# EAGLE design Main_board (EAGLE 6.2)
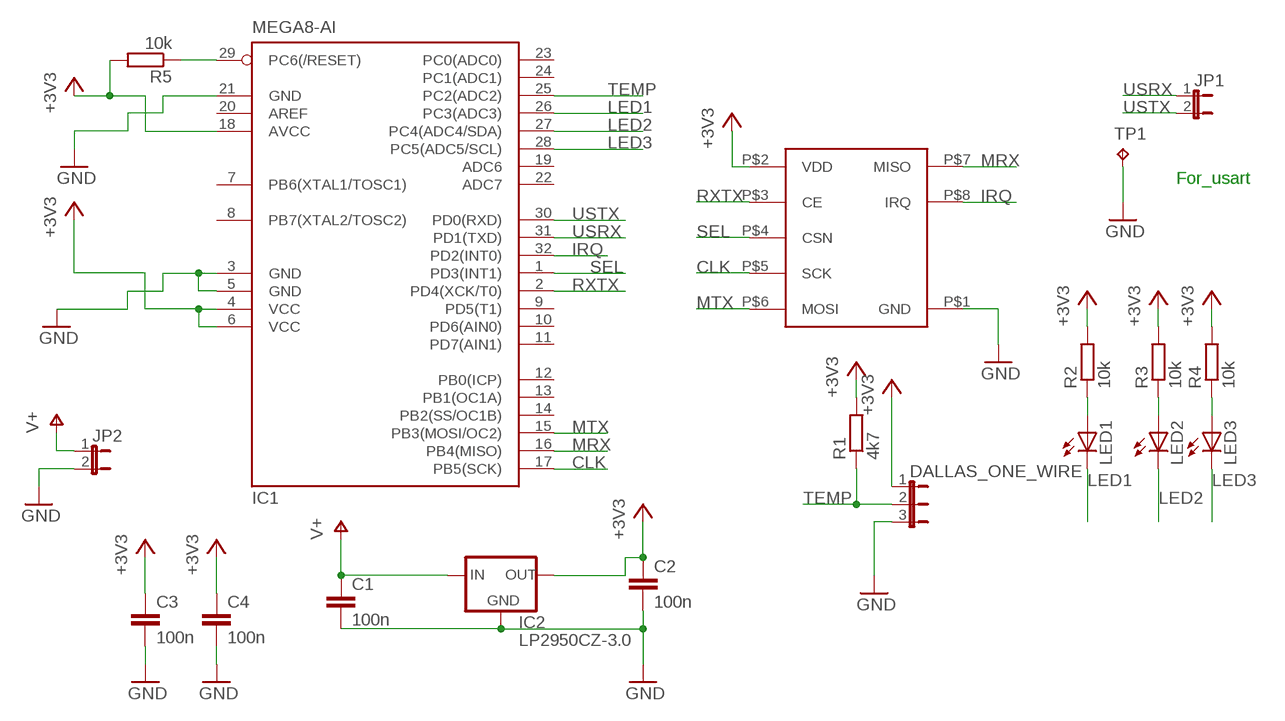
[diagram p0: schematic, sheet 1]

## Parts
C1  100n  C-EUC1206  [C1206]
C2  100n  C-EUC1206  [C1206]
C3  100n  C-EUC1206  [C1206]
C4  100n  C-EUC1206  [C1206]
DALLAS_ONE_WIRE  JP2E  [JP2]
IC1  MEGA8-AI  [TQFP32-08]
IC2  LP2950CZ-3.0  [TO92]
JP1  JP1E  [JP1]
JP2  JP1E  [JP1]
LED1  LEDSMT1206  [1206]
LED2  LEDSMT1206  [1206]
LED3  LEDSMT1206  [1206]
R1  4k7  R-EU_M1206  [M1206]
R2  10k  R-EU_M1206  [M1206]
R3  10k  R-EU_M1206  [M1206]
R4  10k  R-EU_M1206  [M1206]
R5  10k  R-EU_M1206  [M1206]
TP1  TPB2,54  [B2,54]
U$1  RFM70D  [RFM70D]

## Nets
+3V3: C2.1 C3.1 C4.1 DALLAS_ONE_WIRE.1 IC1.4(VCC) IC1.6(VCC) IC1.18(AVCC) IC2.1(OUT) R1.2 R2.2 R3.2 R4.2 R5.2 U$1.P$2(VDD)
CLK: IC1.17(PB5(SCK)) U$1.P$5(SCK)
GND: C1.2 C2.2 C3.2 C4.2 DALLAS_ONE_WIRE.3 IC1.3(GND) IC1.5(GND) IC1.21(GND) IC2.2(GND) JP2.2 TP1.TP U$1.P$1(GND)
IRQ: IC1.32(PD2(INT0)) U$1.P$8(IRQ)
LED1: IC1.26(PC3(ADC3)) LED1.C
LED2: IC1.27(PC4(ADC4/SDA)) LED2.C
LED3: IC1.28(PC5(ADC5/SCL)) LED3.C
MRX: IC1.16(PB4(MISO)) U$1.P$7(MISO)
MTX: IC1.15(PB3(MOSI/OC2)) U$1.P$6(MOSI)
N$1: LED1.A R2.1
N$2: LED2.A R3.1
N$3: LED3.A R4.1
N$4: IC1.29(PC6(/RESET)) R5.1
RXTX: IC1.2(PD4(XCK/T0)) U$1.P$3(CE)
SEL: IC1.1(PD3(INT1)) U$1.P$4(CSN)
TEMP: DALLAS_ONE_WIRE.2 IC1.25(PC2(ADC2)) R1.1
USRX: IC1.31(PD1(TXD)) JP1.1
USTX: IC1.30(PD0(RXD)) JP1.2
V+: C1.1 IC2.3(IN) JP2.1
Unconnected: IC1.7(PB6(XTAL1/TOSC1)) IC1.8(PB7(XTAL2/TOSC2)) IC1.9(PD5(T1)) IC1.10(PD6(AIN0)) IC1.11(PD7(AIN1)) IC1.12(PB0(ICP)) IC1.13(PB1(OC1A)) IC1.14(PB2(SS/OC1B)) IC1.19(ADC6) IC1.20(AREF) IC1.22(ADC7) IC1.23(PC0(ADC0)) IC1.24(PC1(ADC1))

## Notes on the sheet
- For_usart

## Library data of the parts
C1-C4 = rcl:C-EU: CAPACITOR, European symbol
DALLAS_ONE_WIRE = jumper:JP2E: JUMPER
IC1 = atmel:MEGA8: MICROCONTROLLER 8 Kbytes FLASH, 1 kbytes SRAM, 512 bytes EEPROM, USART, 6-channel 10 bit ADC, 2-channel 8 bit ADC Pin compatible with Atmega48, ATMega88, ATMega168 Source: avr.lbr; MPN: ATMEGA8-16AU; OC_FARNELL: 9171371; OC_NEWARK: 73M8863
IC2 = v-reg:LP2950?*: Source: http://cache.national.com/ds/LP/LP2950.pdf
JP1 JP2 = jumper:JP1E: JUMPER
LED1-LED3 = led:LED: LED OSRAM: - CHIPLED LG R971, LG N971, LY N971, LG Q971, LY Q971, LO R971, LY R971 LH N974, LH R974 LS Q976, LO Q976, LY Q976 LO Q996 - Hyper CHIPLED LW Q18S LB Q993, LB Q99A, LB R99A - SideLED LS A670, LO A670, LY A670, LG A670, LP A670 LB A673, LV A673, LT A673, LW A673 LH A674 LY A675 LS A676, LA A676, LO A676, LY A676, LW A676 LS A679, LY A679, LG A679 - Hyper Micro SIDELED® LS Y876, LA Y876, LO Y876, LY Y876 LT Y87S - SmartLED LW L88C, LW L88S LB L89C, LB L89S, LG L890 LS L89K, LO L89K, LY L89K LS L896, LA L896, LO L896, LY L896 - TOPLED LS T670, LO T670, LY T670, LG T670, LP T670 LSG T670, LSP T670, LSY T670, LOP T670, LYG T670 LG T671, LOG T671, LSG T671 LB T673, LV T673, LT T673, LW T673 LH T674 LS T676, LA T676, LO T676, LY T676, LB T676, LH T676, LSB T676, LW T676 LB T67C, LV T67C, LT T67C, LS T67K, LO T67K, LY T67K, LW E67C LS E67B, LA E67B, LO E67B, LY E67B, LB E67C, LV E67C, LT E67C LW T67C LS T679, LY T679, LG T679 LS T770, LO T770, LY T770, LG T770, LP T770 LB T773, LV T773, LT T773, LW T773 LH T774 LS E675, LA E675, LY E675, LS T675 LS T776, LA T776, LO T776, LY T776, LB T776 LHGB T686 LT T68C, LB T68C - Hyper Mini TOPLED® LB M676 - Mini TOPLED Santana® LG M470 LS M47K, LO M47K, LY M47K Source: http://www.osram.convergy.de LUXEON: - LUMILED® LXK2-PW12-R00, LXK2-PW12-S00, LXK2-PW14-U00, LXK2-PW14-V00 LXK2-PM12-R00, LXK2-PM12-S00, LXK2-PM14-U00 LXK2-PE12-Q00, LXK2-PE12-R00, LXK2-PE12-S00, LXK2-PE14-T00, LXK2-PE14-U00 LXK2-PB12-K00, LXK2-PB12-L00, LXK2-PB12-M00, LXK2-PB14-N00, LXK2-PB14-P00, LXK2-PB14-Q00 LXK2-PR12-L00, LXK2-PR12-M00, LXK2-PR14-Q00, LXK2-PR14-R00 LXK2-PD12-Q00, LXK2-PD12-R00, LXK2-PD12-S00 LXK2-PH12-R00, LXK2-PH12-S00 LXK2-PL12-P00, LXK2-PL12-Q00, LXK2-PL12-R00 Source: www.luxeon.com KINGBRIGHT: KA-3528ASYC Source: www.kingbright.com
R1-R5 = rcl:R-EU_: RESISTOR, European symbol
TP1 = testpad:TP: Test pad
U$1 = RFM_Modules:RFM70D

## Board
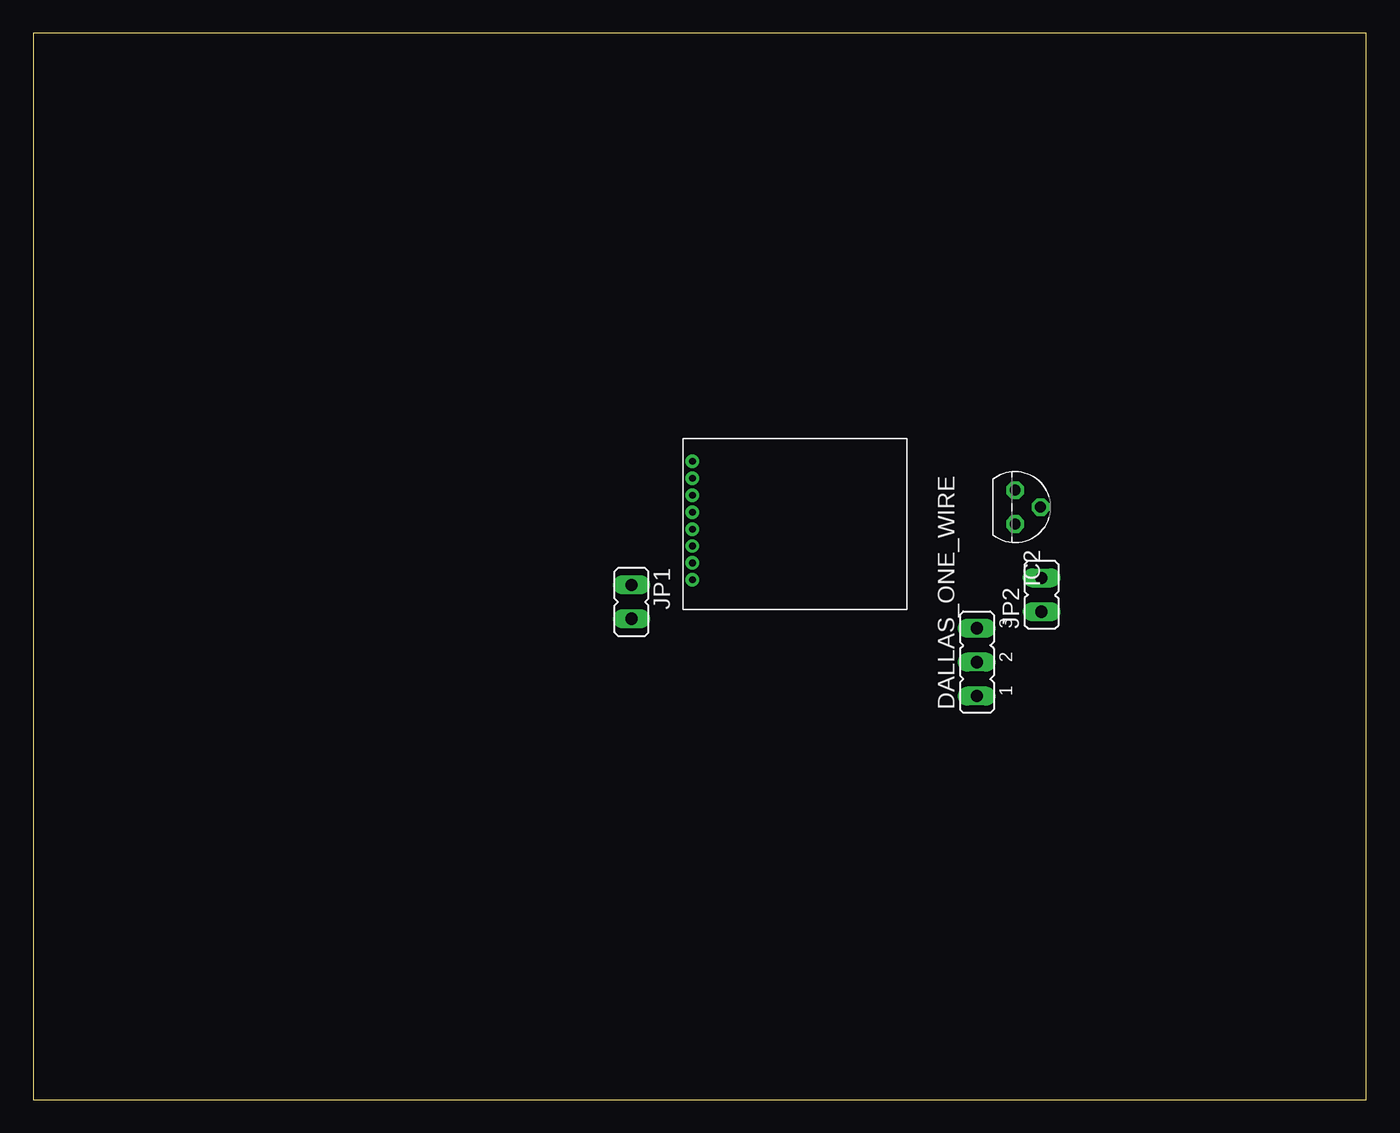
[diagram p1: board, top side]
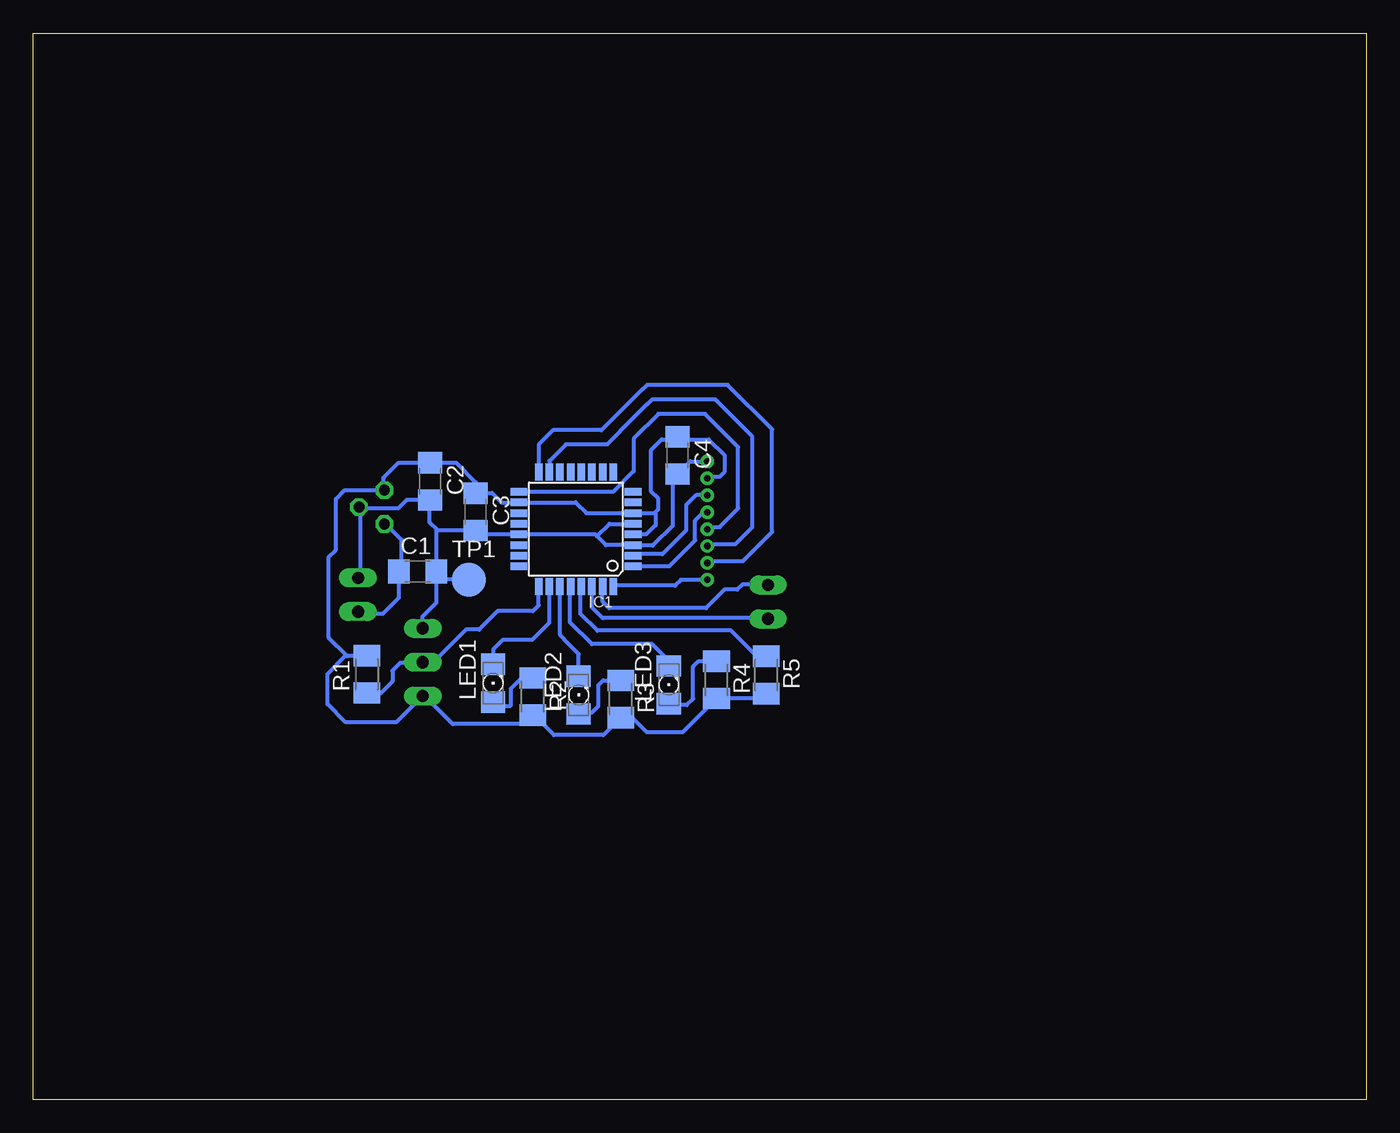
[diagram p2: board, bottom side, seen from below]

Size 100 x 80 mm. Coordinates in mm from the lower left corner, seen from the top.
Outline: 0,0 100,0 100,80 0,80 0,0
Copper layers (1*16): Top 0.035mm / dielectric 1.5mm / Bottom 0.035mm
Design rules: minimum track width 10mil, minimum drill 24mil, track to track 8mil, track to pad 8mil, pad to pad 8mil, via to via 8mil, smd to smd 8mil, copper to edge 40mil, drill to drill 8mil, minimum pad ring 10mil, minimum via ring 8mil, stop-mask expansion 4mil, vias tented up to drill 0mil, thermal gap 10mil

### Footprints (pad centres in the part's own frame; a part is rotated, then mirrored left to right if it is on the bottom)
C1206 = smd 1.6 x 1.8: 1 -1.4,0; 2 1.4,0
JP2 = drill 0.914 long: 1 -2.54,0; 2 0,0; 3 2.54,0
TQFP32-08 = smd 1.27 x 0.559: 1 -4.293,2.8; 2 -4.293,2; 3 -4.293,1.2; 4 -4.293,0.4; 5 -4.293,-0.4; 6 -4.293,-1.2; 7 -4.293,-2; 8 -4.293,-2.8; 17 4.293,-2.8; 18 4.293,-2; 19 4.293,-1.2; 20 4.293,-0.4; 21 4.293,0.4; 22 4.293,1.2; 23 4.293,2; 24 4.293,2.8 | smd 0.559 x 1.27: 9 -2.8,-4.293; 10 -2,-4.293; 11 -1.2,-4.293; 12 -0.4,-4.293; 13 0.4,-4.293; 14 1.2,-4.293; 15 2,-4.293; 16 2.8,-4.293; 25 2.8,4.293; 26 2,4.293; 27 1.2,4.293; 28 0.4,4.293; 29 -0.4,4.293; 30 -1.2,4.293; 31 -2,4.293; 32 -2.8,4.293
TO92 = drill 0.813 octagon: 1 -1.27,0; 2 0,1.905; 3 1.27,0
JP1 = drill 0.914 long: 1 0,-1.27; 2 0,1.27
1206 = smd 1.6 x 1.803: A -1.422,0; C 1.422,0
M1206 = smd 1.6 x 2: 1 -1.4,0; 2 1.4,0
B2,54 = smd 2.54 x 2.54: TP 0,0
RFM70D = drill 0.5: P$1 -7.7,4.7; P$2 -7.7,3.43; P$3 -7.7,2.16; P$4 -7.7,0.89; P$5 -7.7,-0.38; P$6 -7.7,-1.65; P$7 -7.7,-2.92; P$8 -7.7,-4.19

### Placement (x,y rotation side)
C1  71.17,39.62 0 bottom
C2  70.23,46.38 270 bottom
C3  66.8,44.09 270 bottom
C4  51.66,48.34 270 bottom
DALLAS_ONE_WIRE  70.79,32.82 90 top
IC1  59.28,42.8 180 bottom
IC2  73.66,44.45 270 top
JP1  44.88,37.34 180 top
JP2  75.64,37.87 0 top
LED1  65.51,31.24 90 bottom
LED2  59.08,30.35 90 bottom
LED3  52.32,31.11 90 bottom
R1  74.98,31.9 90 bottom
R2  62.53,30.23 270 bottom
R3  55.93,30.05 270 bottom
R4  48.74,31.5 270 bottom
R5  45.01,31.85 270 bottom
TP1  67.34,39.01 0 bottom
U$1  57.15,43.18 0 top

### Tracks (layer width: path | path; a pad name or v marks a point on that pad's centre or on a via)
+3V3
  Bottom 0.305: 53.41,44 IC1.6 58.5,44 59.3,44.8 IC1.18 64.86,44.8 65.58,45.52 66.78,45.52 C3.1 66.8,46.3 68.28,47.78 C2.1 72.59,47.78 73.71,46.66 73.71,45.77 IC2.1 76.63,45.72 77.29,45.06 77.29,41.25 77.83,40.72 77.83,34.65 76.45,33.27 75.01,33.27 R1.2 76.55,33.3 77.93,31.93 77.93,29.67 76.56,28.3 72.77,28.3 DALLAS_ONE_WIRE.1 70.64,30.28 68.53,28.17 63.19,28.17 R2.2 62.41,28.83 60.94,27.36 57.22,27.36 R3.2 55.04,28.65 53.95,27.56 51.28,27.56 R4.2 45.36,30.1 R5.2 | 53.41,44 53.11,44.3 53.11,45.09 53.65,45.62 53.65,48.74 52.86,49.53 51.87,49.53 | IC1.4 54.02,42.4 53.31,43.1 53.31,43.9 53.41,44 | 51.87,49.53 C4.1 | 51.87,49.53 49.33,49.53 48.16,48.36 48.16,47.07 48.51,46.71 49.35,46.71 U$1.P$2
CLK
  Bottom 0.305: IC1.17 56.51,45.6 54.97,47.14 54.97,49.58 53.11,51.44 49.61,51.44 47.12,48.95 47.12,44.35 48.51,42.95 49.3,42.95 U$1.P$5
GND
  Bottom 0.305: 69.64,42.69 C3.2 66.51,42.4 IC1.21 57.84,42.4 57.71,42.27 | 69.64,42.69 70.26,43.31 70.26,44.95 C2.2 72.01,44.98 72.64,44.35 75.46,44.35 | 75.46,44.35 IC2.2 | 75.46,44.35 75.46,39.32 JP2.2 | 69.64,42.69 69.77,42.69 C1.2 | C1.2 69.77,37.27 70.81,36.22 70.81,35.38 DALLAS_ONE_WIRE.3 | 57.71,42.27 57.05,41.6 IC1.3 54.95,41.55 53.54,41.55 52.02,43.08 52.02,46.58 C4.2 50.72,47.88 U$1.P$1 | IC1.5 56.77,43.2 57.71,42.27 | TP1.TP 69.16,39.01 C1.2
IRQ
  Bottom 0.305: IC1.32 56.43,38.56 51.84,38.56 51.41,38.99 U$1.P$8
LED1
  Bottom 0.305: IC1.26 61.28,35.8 62.56,34.52 64.75,34.52 65.46,33.81 65.46,32.72 LED1.C
LED2
  Bottom 0.305: LED2.C 59.08,33.43 60.15,34.49 60.15,34.52 60.48,34.85 IC1.27
LED3
  Bottom 0.305: LED3.C 52.32,32.89 53.59,34.16 58.09,34.16 59.72,35.79 59.72,38.48 IC1.28
MRX
  Bottom 0.305: IC1.16 62.08,49.14 61.01,50.22 57.38,50.22 54.28,53.31 54.25,53.31 53.95,53.62 47.9,53.62 44.58,50.29 44.58,42.6 46.79,40.39 49.32,40.39 U$1.P$7
MTX
  Bottom 0.305: IC1.15 61.28,47.91 60.05,49.15 56.95,49.15 56.01,50.09 56.01,50.11 53.95,52.17 53.92,52.17 53.59,52.5 48.82,52.5 46.05,49.73 46.05,42.95 47.35,41.66 49.32,41.66 U$1.P$6
N$1
  Bottom 0.305: R2.1 63.37,31.63 64.16,30.84 64.16,29.59 64.21,29.54 65.23,29.54 LED1.A
N$2
  Bottom 0.305: R3.1 57.25,31.45 57.61,31.09 57.61,29.52 58.09,29.03 58.98,29.03 LED2.A
N$3
  Bottom 0.305: R4.1 50.09,32.9 50.49,32.49 50.49,30.07 50.98,29.59 52.22,29.59 LED3.A
N$4
  Bottom 0.305: R5.1 45.77,33.25 45.77,33.3 47.65,35.18 57.68,35.18 58.95,36.45 58.95,38.44 IC1.29
RXTX
  Bottom 0.305: U$1.P$3 50.29,45.34 51.03,44.6 51.03,42.7 52.81,40.92 54.87,40.92 IC1.2
SEL
  Bottom 0.305: U$1.P$4 49.71,44.07 50.34,43.43 50.34,41.96 52.3,40.01 IC1.1
TEMP
  Bottom 0.305: R1.1 73.92,30.5 73.05,31.37 73.05,32.18 72.47,32.77 70.97,32.77 DALLAS_ONE_WIRE.2 69.88,32.92 67.54,35.26 66.55,35.26 65.15,36.65 62.51,36.65 62.08,37.08 IC1.25
USRX
  Bottom 0.305: IC1.31 57.28,37.37 56.79,36.88 49.53,36.88 48.16,38.25 47.19,38.25 46.79,38.66 44.93,38.66 JP1.1
USTX
  Bottom 0.305: IC1.30 58.08,36.92 57.28,36.12 44.93,36.12 JP1.2
V+
  Bottom 0.305: IC2.3 73.56,43.18 72.36,41.99 72.36,39.83 C1.1 72.57,37.66 73.79,36.45 75.49,36.45 JP2.1